# Altium schematic sheet MCUv1.2.SchDoc
size A4
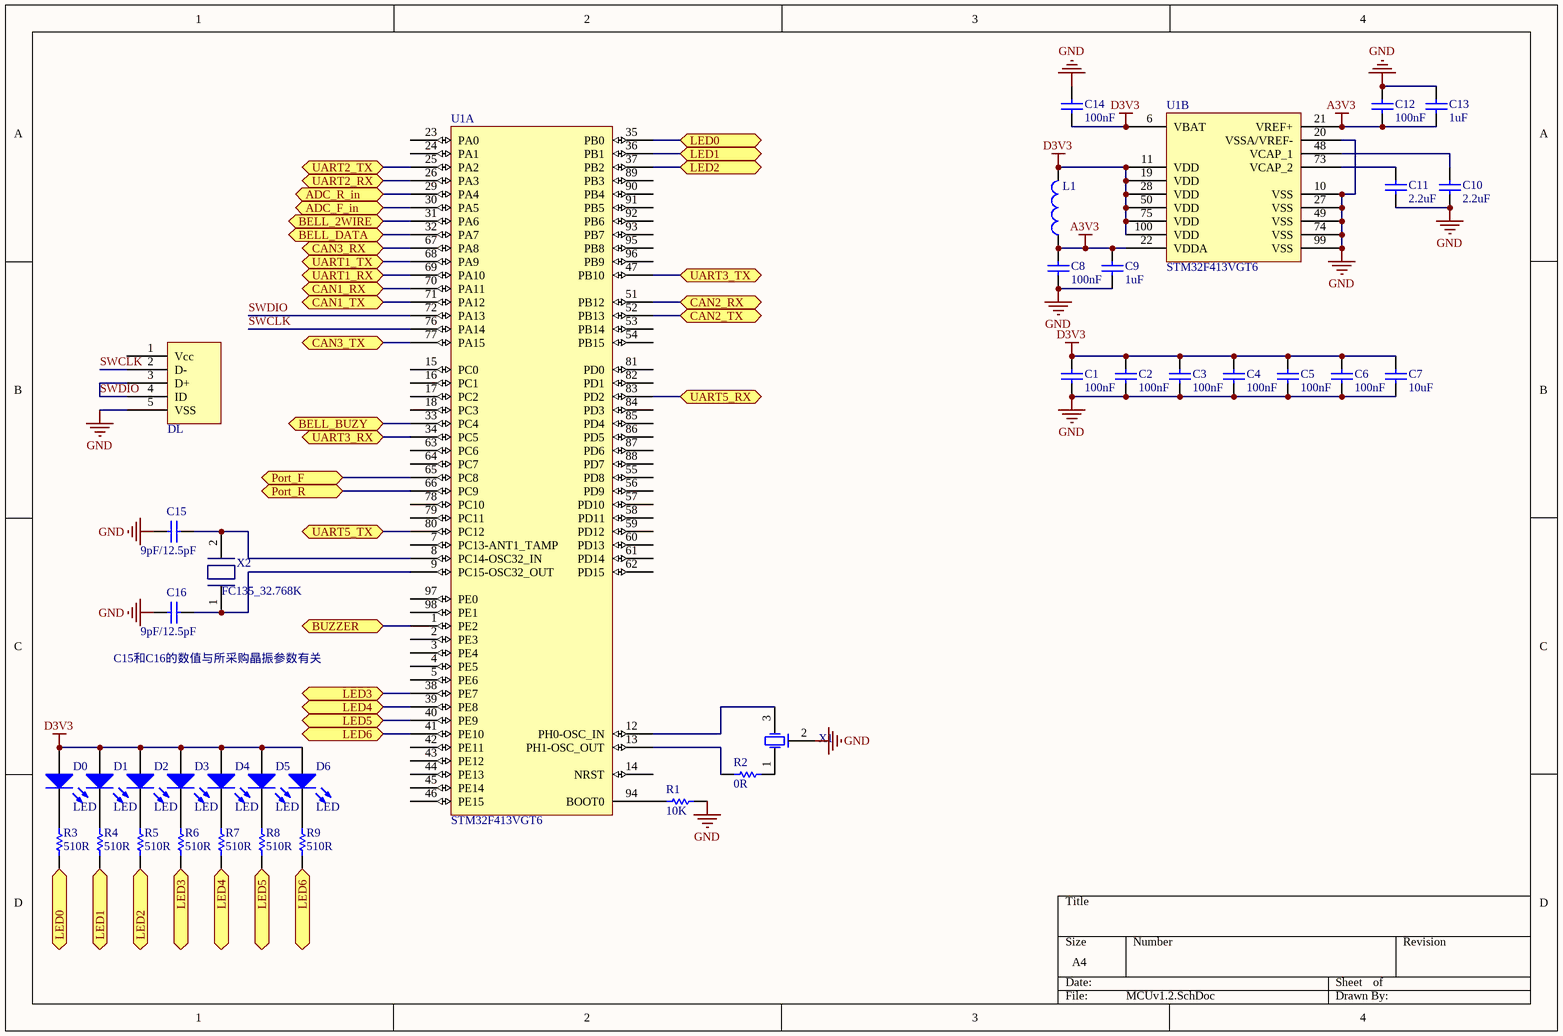
[diagram p0: MCUv1.2.SchDoc]

## Parts
C1  100nF  [0402]
C2  100nF  [0402]
C3  100nF  [0402]
C4  100nF  [0402]
C5  100nF  [0402]
C6  100nF  [0402]
C7  10uF  [0805]
C8  100nF  [0402]
C9  1uF  [0402]
C10  2.2uF  [0603]
C11  2.2uF  [0603]
C12  100nF  [0402]
C13  1uF  [0402]
C14  100nF  [0402]
C15  9pF/12.5pF  [0402]
C16  9pF/12.5pF  [0402]
D0  LED  [1206]
D1  LED  [1206]
D2  LED  [1206]
D3  LED  [1206]
D4  LED  [1206]
D5  LED  [1206]
D6  LED  [1206]
DL  USB_5pin  [USBmicro_B]  (value not drawn)
L1  BLM15BD221SN1D  [0402]  (value not drawn)
R1  10K  [0402]
R2  0R  [0402]
R3  510R  [0402]
R4  510R  [0402]
R5  510R  [0402]
R6  510R  [0402]
R7  510R  [0402]
R8  510R  [0402]
R9  510R  [0402]
U1  STM32F413VGT6  [STM-LQFP100_V]  (parts A,B of 2)
X1  8M smd  [8Mhz_XTAL]  (value not drawn)
X2  FC135_32.768K  [FC135]

## Ports
ADC_F_in (bidir), ADC_R_in (bidir), BELL_2WIRE, BELL_BUZY, BELL_DATA, BUZZER, CAN1_RX, CAN1_TX, CAN2_RX, CAN2_TX, CAN3_RX, CAN3_TX, LED0, LED1, LED2, LED3, LED4, LED5, LED6, Port_F (bidir), Port_R (bidir), UART1_RX, UART1_TX, UART2_RX, UART2_TX, UART3_RX, UART3_TX, UART5_RX, UART5_TX

## Nets
A3V3: C8.2 C9.2 C12.1 C13.1 L1.1 U1.21(VREF+) U1.22(VDDA)
D3V3: C1.2 C2.2 C3.2 C4.2 C5.2 C6.2 C7.2 C14.1 D0.1(A) D1.1(A) D2.1(A) D3.1(A) D4.1(A) D5.1(A) D6.1(A) L1.2 U1.6(VBAT) U1.11(VDD) U1.19(VDD) U1.28(VDD) U1.50(VDD) U1.75(VDD) U1.100(VDD)
GND: C1.1 C2.1 C3.1 C4.1 C5.1 C6.1 C7.1 C8.1 C9.1 C10.1 C11.1 C12.2 C13.2 C14.2 C15.2 C16.2 DL.5(VSS) R1.2 U1.10(VSS) U1.20(VSSA/VREF-) U1.27(VSS) U1.49(VSS) U1.74(VSS) U1.99(VSS) X1.2(GND)
ADC_F_in: U1.30(PA5) ; port ADC_F_in
ADC_R_in: U1.29(PA4) ; port ADC_R_in
BELL_2WIRE: U1.31(PA6) ; port BELL_2WIRE
BELL_BUZY: U1.33(PC4) ; port BELL_BUZY
BELL_DATA: U1.32(PA7) ; port BELL_DATA
BUZZER: U1.1(PE2) ; port BUZZER
CAN1_RX: U1.70(PA11) ; port CAN1_RX
CAN1_TX: U1.71(PA12) ; port CAN1_TX
CAN2_RX: U1.51(PB12) ; port CAN2_RX
CAN2_TX: U1.52(PB13) ; port CAN2_TX
CAN3_RX: U1.67(PA8) ; port CAN3_RX
CAN3_TX: U1.77(PA15) ; port CAN3_TX
LED0: R3.1 U1.35(PB0) ; port LED0
LED1: R4.1 U1.36(PB1) ; port LED1
LED2: R5.1 U1.37(PB2) ; port LED2
LED3: R6.1 U1.38(PE7) ; port LED3
LED4: R7.1 U1.39(PE8) ; port LED4
LED5: R8.1 U1.40(PE9) ; port LED5
LED6: R9.1 U1.41(PE10) ; port LED6
Port_F: U1.65(PC8) ; port Port_F
Port_R: U1.66(PC9) ; port Port_R
SWCLK: DL.2(D-) U1.76(PA14)
SWDIO: DL.3(D+) DL.4(ID) U1.72(PA13)
UART1_RX: U1.69(PA10) ; port UART1_RX
UART1_TX: U1.68(PA9) ; port UART1_TX
UART2_RX: U1.26(PA3) ; port UART2_RX
UART2_TX: U1.25(PA2) ; port UART2_TX
UART3_RX: U1.34(PC5) ; port UART3_RX
UART3_TX: U1.47(PB10) ; port UART3_TX
UART5_RX: U1.83(PD2) ; port UART5_RX
UART5_TX: U1.80(PC12) ; port UART5_TX
NetC10_2: C10.2 U1.48(VCAP_1)
NetC11_2: C11.2 U1.73(VCAP_2)
NetC15_1: C15.1 U1.8(PC14-OSC32_IN) X2.2
NetC16_1: C16.1 U1.9(PC15-OSC32_OUT) X2.1
NetD0_2: D0.2(K) R3.2
NetD1_2: D1.2(K) R4.2
NetD2_2: D2.2(K) R5.2
NetD3_2: D3.2(K) R6.2
NetD4_2: D4.2(K) R7.2
NetD5_2: D5.2(K) R8.2
NetD6_2: D6.2(K) R9.2
NetR1_1: R1.1 U1.94(BOOT0)
NetR2_1: R2.1 X1.1(OSC1)
NetR2_2: R2.2 U1.13(PH1-OSC_OUT)
NetU1_12: U1.12(PH0-OSC_IN) X1.3(OSC2)

Not connected (* = marked no-connect by the designer): DL 1(Vcc); U1 2(PE3) 3(PE4) 4(PE5) 5(PE6) 7(PC13-ANT1_TAMP) 14(NRST) 15(PC0) 16(PC1) 17(PC2) 18(PC3) 23(PA0) 24(PA1) 42(PE11) 43(PE12) 44(PE13) 45(PE14) 46(PE15) 53(PB14) 54(PB15) 55(PD8) 56(PD9) 57(PD10) 58(PD11) 59(PD12) 60(PD13) 61(PD14) 62(PD15) 63(PC6) 64(PC7) 78(PC10) 79(PC11) 81(PD0) 82(PD1) 84(PD3) 85(PD4) 86(PD5) 87(PD6) 88(PD7) 89(PB3) 90(PB4) 91(PB5) 92(PB6) 93(PB7) 95(PB8) 96(PB9) 97(PE0) 98(PE1)

## Notes on the sheet
- (near C16) C15和C16的数值与所采购晶振参数有关

## Library data of the parts
C1-C6 C8 C12 C14 = Cap: Capacitor; Published: 8-Jun-2000; LatestRevisionDate: 17-Jul-2002; LatestRevisionNote: Re-released for DXP Platform.; PackageReference: RAD-0.3; Publisher: Altium Limited; PackageDescription: Radial Cap, Thru-Hole; 2 Leads; 0.3 in Pin Spacing; Value: 100nF
C7 C9-C11 C13 C15 C16 = Cap: Capacitor; Value: 100nF; Published: 8-Jun-2000; LatestRevisionDate: 17-Jul-2002; LatestRevisionNote: Re-released for DXP Platform.; PackageReference: RAD-0.3; Publisher: Altium Limited; PackageDescription: Radial Cap, Thru-Hole; 2 Leads; 0.3 in Pin Spacing
D0-D6 = LED0: green LED; Published: 8-Jun-2000; LatestRevisionDate: 08-Jul-2005; LatestRevisionNote: Mech Layer 1 removed.; PackageReference: LED-0; Publisher: Altium Limited; PackageDescription: LED; 2 Leads
L1 = Inductor: muRata ferrite bead; Code_IEC: 1005; Value: 10mH; Published: 8-Jun-2000; LatestRevisionDate: 29-May-2009; LatestRevisionNote: IPC-7351 Footprint Added.; PackageReference: 0402-A; Publisher: Altium Limited; PackageDescription: Chip Inductor; Code_JEITA: 0402
R1 R3-R9 = Res1: Resistor; Value: 1K; Published: 8-Jun-2000; LatestRevisionDate: 17-Jul-2002; LatestRevisionNote: Re-released for DXP Platform.; PackageReference: AXIAL-0.3; Publisher: Altium Limited; PackageDescription: Axial Device, Thru-Hole; 2 Leads; 0.3 in Pin Spacing
R2 = Res1: Resistor; Value: 100R; Published: 8-Jun-2000; LatestRevisionDate: 17-Jul-2002; LatestRevisionNote: Re-released for DXP Platform.; PackageReference: AXIAL-0.3; Publisher: Altium Limited; PackageDescription: Axial Device, Thru-Hole; 2 Leads; 0.3 in Pin Spacing
U1 = CMP-1771-00004-1: ARM Cortex-M4 32-Bit DSP+FPU, 1024 KB Flash, 82 I/Os, 100-Pin LQFP, -40 to 85 degC, Tray; ComponentLink1URL: http://www.st.com/; PackageDescription: 100-Pin Low Profile Quad Flat Package, Body 14 x 14 mm, Pitch 0.5 mm; Mounting Technology: Surface Mount; PackageReference: LQFP100; ComponentLink1Description: Manufacturer URL; DatasheetVersion: Rev. 1; PartId: 1
X1 = 8M smd: muRata
X2 = XTAL_32.768k